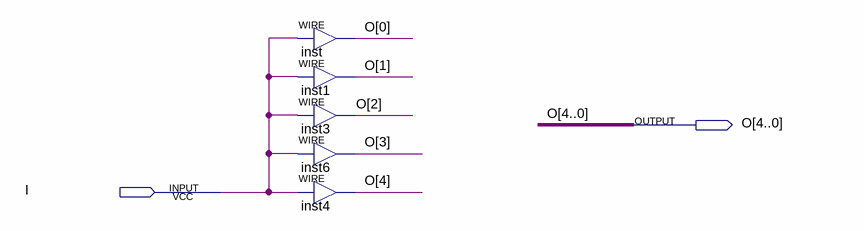
[diagram p0: schematic sheet]
// Quartus schematic Extend5.bdf as structural Verilog: 5 symbols, 2 pins
module Extend5 (
  input  I,
  output [4:0] O
);

  assign O[0] = I;  // WIRE inst
  assign O[1] = I;  // WIRE inst1
  assign O[2] = I;  // WIRE inst3
  assign O[3] = I;  // WIRE inst6
  assign O[4] = I;  // WIRE inst4
endmodule
